# Altium schematic sheet Voltage_Current_Sense.SchDoc
size A4; SheetNumber: 10; SheetTotal: 13
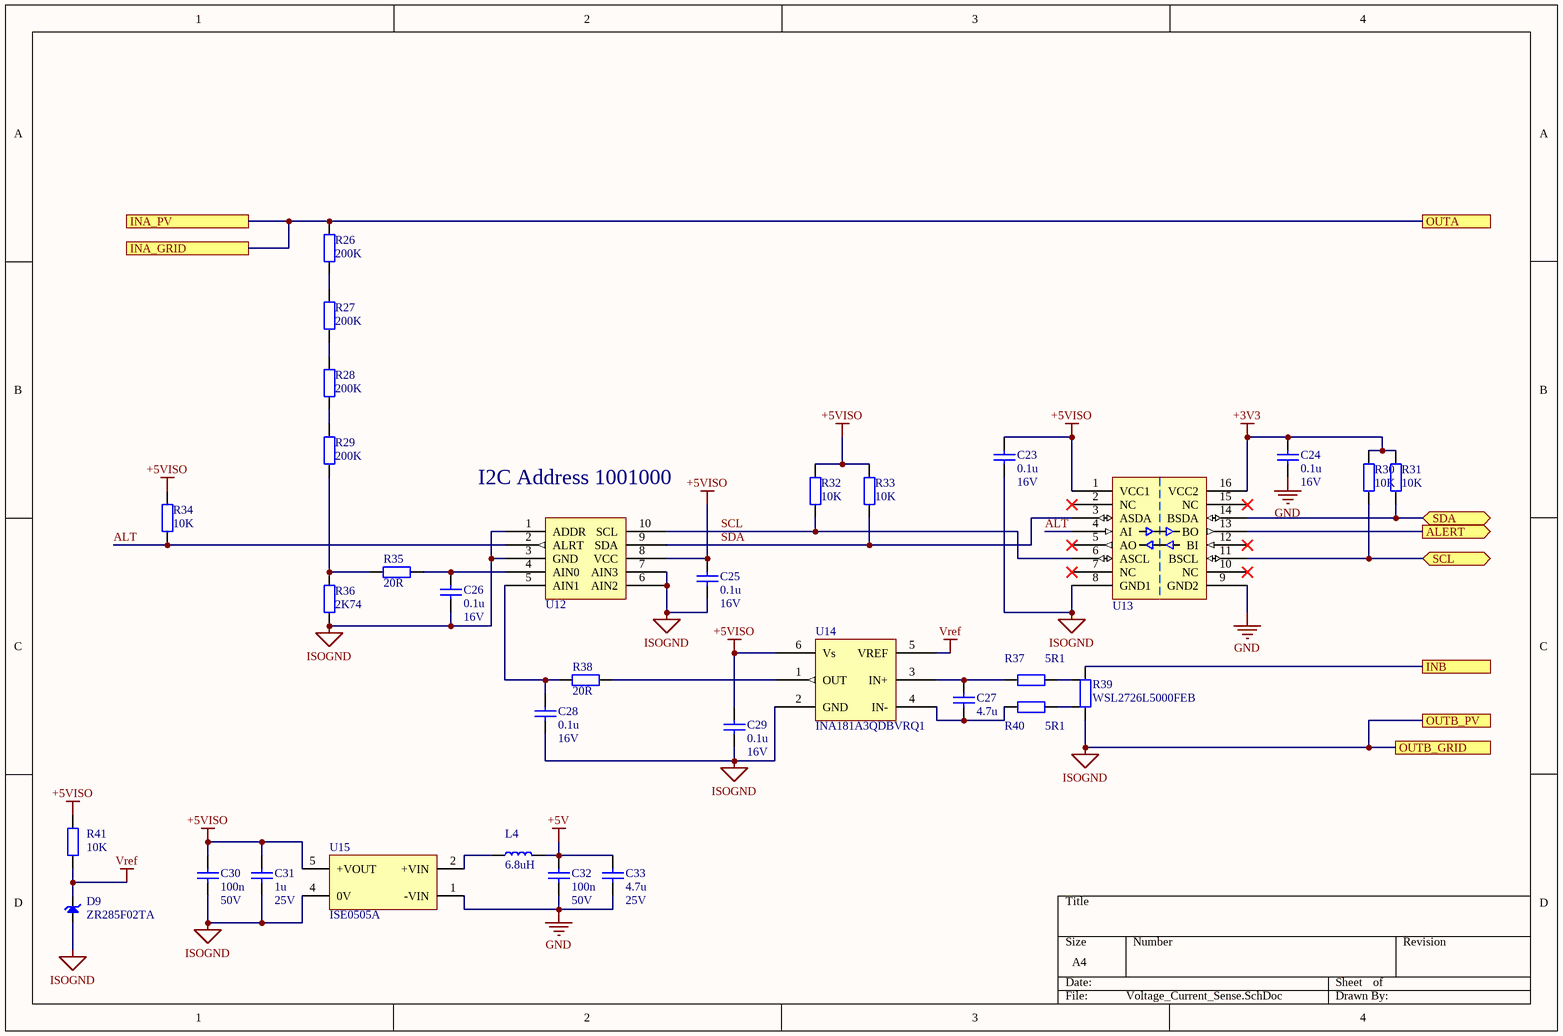
[diagram p0: Voltage_Current_Sense.SchDoc]

## Parts
C23  0.1u  Voltage - Rated: 16V  [CAP 0603/1608]
C24  0.1u  Voltage - Rated: 16V  [CAP 0603/1608]
C25  0.1u  Voltage - Rated: 16V  [CAP 0603/1608]
C26  0.1u  Voltage - Rated: 16V  [CAP 0603/1608]
C27  4.7u  [CAP 0805/2012 - 1.4MM]
C28  0.1u  Voltage - Rated: 16V  [CAP 0603/1608]
C29  0.1u  Voltage - Rated: 16V  [CAP 0603/1608]
C30  100n  Voltage - Rated: 50V  [CAP 0603/1608]
C31  1u  Voltage - Rated: 25V  [CAP 0603/1608]
C32  100n  Voltage - Rated: 50V  [CAP 0603/1608]
C33  4.7u  Voltage - Rated: 25V  [CAP 0603/1608]
D9  ZR285F02TA  [ZR285F02TA]
L4  6.8uH  [1210L]
R26  200K  [RES 1206/3216]
R27  200K  [RES 1206/3216]
R28  200K  [RES 1206/3216]
R29  200K  [RES 1206/3216]
R30  10K  [RES 0603/1608]
R31  10K  [RES 0603/1608]
R32  10K  [RES 0603/1608]
R33  10K  [RES 0603/1608]
R34  10K  [RES 0603/1608]
R35  20R  [RES 0603/1608]
R36  2K74  [RES 1206/3216]
R37  5R1  [RES 0603/1608]
R38  20R  [RES 0603/1608]
R39  WSL2726L5000FEB  [WSL2726L5000FEB]
R40  5R1  [RES 0603/1608]
R41  10K  [RES 0603/1608]
U12  ADS1015IDGSR  [ADS1015IDGSR]  (value not drawn)
U13  SI8605AC-B-IS1R  [SI8605AC-B-IS1R]  (value not drawn)
U14  INA181A3QDBVRQ1  [INA181A3QDBVRQ1]
U15  ISE0505A  [XP ISE 8-SMD]

## Ports
ALERT (out), INA_GRID, INA_PV, INB, OUTA, OUTB_GRID, OUTB_PV, SCL (bidir), SDA (bidir)

## Nets
+3V3: C24.2 R30.2 R31.2 U13.16(VCC2)
+5V: C32.1 C33.2 L4.1
+5VISO: C23.2 C25.2 C29.2 C30.2 C31.2 R32.2 R33.2 R34.2 R41.2 U12.8(VCC) U13.1(VCC1) U14.6(Vs) U15.5(+VOUT)
GND: C24.1 C32.2 C33.1 U13.9(GND2) U15.1(-VIN)
ISOGND: C23.1 C25.1 C26.1 C28.2 C29.1 C30.1 C31.1 D9.A R36.1 R39.1 U12.1(ADDR) U12.3(GND) U12.6(AIN2) U12.7(AIN3) U13.8(GND1) U14.2(GND) U15.4(0V) ; port OUTB_PV, port OUTB_GRID
Vref: D9.K R41.1 U14.5(VREF)
ALERT: U13.13(BO) ; port ALERT
ALT: R34.1 U12.2(ALRT) U13.4(AI)
INA_GRID: R26.2 ; port INA_PV, port OUTA, port INA_GRID
INB: R39.2 ; port INB
SCL: R32.1 U12.10(SCL) U13.6(ASCL)
SCL: R30.1 U13.11(BSCL) ; port SCL  [a separate net that carries the same name]
SDA: R33.1 U12.9(SDA) U13.3(ASDA)
SDA: R31.1 U13.14(BSDA) ; port SDA  [a separate net that carries the same name]
NetC26_2: C26.2 R35.2 U12.4(AIN0)
NetC27_1: C27.1 R40.1 U14.4(IN-)
NetC27_2: C27.2 R37.1 U14.3(IN+)
NetC28_1: C28.1 R38.2 U12.5(AIN1)
NetL4_2: L4.2 U15.2(+VIN)
NetR26_1: R26.1 R27.2
NetR27_1: R27.1 R28.2
NetR28_1: R28.1 R29.2
NetR29_1: R29.1 R35.1 R36.2
NetR37_2: R37.2 R39.4
NetR38_1: R38.1 U14.1(OUT)
NetR39_3: R39.3 R40.2

Not connected (* = marked no-connect by the designer): U13 2(NC)* 5(AO)* 7(NC)* 10(NC)* 12(BI)* 15(NC)*

## Notes on the sheet
- (near U12) I2C Address 1001000

## Library data of the parts
C23-C26 C28 C29 = GRM188R71C104KA01D: CAP CER 0.1UF 16V X7R 0603; Manufacturer: Murata Electronics North America; Package Imperial: 0603; Package Metric: 1608; Tolerance: 0.1; Value: 0.1u; Part Number: GRM188R71C104KA01D; Dielectric: X7R; Digi-Key Part Number: 490-1532-6-ND
C27 = C0805C475K9RACTU: CAP CER 4.7UF 6.3V X7R 0805; Manufacturer: KEMET; Package Imperial: 0805; Package Metric: 2012; Tolerance: 0.1; Value: 4.7u; Voltage - Rated: 6.3V; Part Number: C0805C475K9RACTU; Dielectric: X7R; Digi-Key Part Number: 399-7417-1-ND
C30 C32 = GCM188R71H104KA57D: CAP CER 0.1UF 50V X7R 0603; Manufacturer: Murata Electronics North America; Package Imperial: 0603; Package Metric: 1608; Value: 100n; Part Number: GCM188R71H104KA57D; Digi-Key Part Number: 490-4779-1-ND
C31 = CL10B105KA8NNNC: CAP CER 1UF 25V X7R 0603; Manufacturer: Samsung Electro-Mechanics; Package Imperial: 0603; Package Metric: 1608; Tolerance: 0.1; Value: 1u; Part Number: CL10B105KA8NNNC; Dielectric: X7R; Digi-Key Part Number: 1276-1184-1-ND
C33 = GRM188C81E475KE11D: CAP CER 4.7UF 25V X6S 0603; Manufacturer: Murata Electronics North America; Package Imperial: 0603; Package Metric: 1608; Tolerance: 0.1; Value: 4.7u; Part Number: GRM188C81E475KE11D; Dielectric: X6S; Digi-Key Part Number: 490-7199-1-ND
D9 = ZR285F02TA: Zener Diode; manufacturer: Diodes Incorporated; inventory_price: 1.51; partnumber: ZR285F02TA; Manufacturer Part Number: ZR285F02TA; URL Datasheet: https://www.diodes.com/assets/Datasheets/ZR285.pdf; Digikey PN: ZR285F02CT-ND; parttype: PMIC - Voltage Reference
L4 = TFM322512ALMA6R8MTAA: Part Number: MLZ2012N6R8LTD25; Manufacturer: TDK Corporation; Maximun Temperature: 150; Minimum Temperature: -55; inventory_price: 1.44; Digi-Key Part Number: 445-16384-1-ND; partnumber: TFM322512ALMA6R8MTAA; Manufacturer Part Number: TDK Corporation; URL Datasheet: https://product.tdk.com/info/en/catalog/datasheets/inductor_automotive_power_tfm322512alma_en.pdf?ref_disty=digikey; Digikey PN: 445-TFM322512ALMA6R8MTAACT-ND; parttype: Fixed Inductor
R26-R29 = RC1206FR-07200KL: RES SMD 200K OHM 1% 1/4W 1206; Manufacturer: Yageo; Package Imperial: 1206; Package Metric: 3216; Temperature Coefficient: ±100ppm/°C; Power (Watts): 0.25W, 1/4W; Part Number: RC1206FR-07200KL; Value: 200K; Tolerance: ±1%; Digi-Key Part Number: 311-200KFRCT-ND
R30-R34 R41 = RC0603FR-0710KL: RES SMD 10K OHM 1% 1/10W 0603; Manufacturer: Yageo; Package Imperial: 0603; Package Metric: 1608; Temperature Coefficient: ±100ppm/°C; Power (Watts): 0.1W, 1/10W; Part Number: RC0603FR-0710KL; Value: 10K; Tolerance: ±1%; Digi-Key Part Number: 311-10.0KHRCT-ND
R35 R38 = RC0603FR-0720RL: RES SMD 20 OHM 1% 1/10W 0603; Manufacturer: Yageo; Package Imperial: 0603; Package Metric: 1608; Temperature Coefficient: ±100ppm/°C; Power (Watts): 0.1W, 1/10W; Part Number: RC0603FR-0720RL; Value: 20R; Tolerance: ±1%; Digi-Key Part Number: 311-20.0HRCT-ND
R36 = RC1206FR-072K74L: RES SMD 2.74K OHM 1% 1/4W 1206; Manufacturer: Yageo; Package Imperial: 1206; Package Metric: 3216; Temperature Coefficient: ±100ppm/°C; Power (Watts): 0.25W, 1/4W; Part Number: RC1206FR-072K74L; Value: 2K74; Tolerance: ±1%; Digi-Key Part Number: 311-2.74KFRCT-ND
R37 R40 = RC0603FR-075R1L: RES SMD 5.1 OHM 1% 1/10W 0603; Manufacturer: Yageo; Package Imperial: 0603; Package Metric: 1608; Temperature Coefficient: ±200ppm/°C; Power (Watts): 0.1W, 1/10W; Part Number: RC0603FR-075R1L; Value: 5R1; Tolerance: ±1%; Digi-Key Part Number: YAG3372CT-ND
R39 = WSL2726L5000FEB: Resistor Symbol; manufacturer: Vishay Dale; inventory_price: 3.82; partnumber: WSL2726L5000FEB; Manufacturer Part Number: WSL2726L5000FEB; URL Datasheet: https://www.vishay.com/docs/30131/wsl2726.pdf; Digikey PN: WSLQ-.0005CT-ND; parttype: Chip Resistor - Surface Mount
U12 = ADS1015IDGSR: IC ADC 12BIT SIGMA-DELTA 10VSSOP; Manufacturer: Texas Instruments; inventory_price: 4.47; ComponentLink1Description: Datasheet; Mount: SMT; Supplier 1: Digi-Key; Manufacturer Part Number: ADS1015IDGSR; Supplier Part Number 1: 296-41185-1-ND; partnumber: ADS1015IDGSR; URL Datasheet: https://www.ti.com/general/docs/suppproductinfo.tsp?distId=10&gotoUrl=https%3A%2F%2Fwww.ti.com%2Flit%2Fgpn%2Fads1013; Digikey PN: 296-41185-1-ND; parttype: Data Acquisition - Analog to Digital Converters (ADC)
U13 = SI8605AC-B-IS1R: DGT ISOL 3750VRMS 4CH I2C 16SOIC; Manufacturer: Skyworks Solutions Inc.; inventory_price: 11.35; Manufacturer Part Number: SI8605AC-B-IS1R; ComponentLink1Description: Datasheet; Mount: SMT; Supplier 1: Digi-Key; Supplier Part Number 1: Silicon Labs; partnumber: SI8605AC-B-IS1R; URL Datasheet: https://www.skyworksinc.com/-/media/Skyworks/SL/documents/public/data-sheets/Si860x.pdf; Digikey PN: 336-4927-1-ND; parttype: Digital Isolators
U14 = INA181A3QDBVRQ1: manufacturer: Texas Instraments; inventory_price: 0.94; partnumber: INA181A3QDBVRQ1; Manufacturer Part Number: INA181A3QDBVRQ1; URL Datasheet: https://www.ti.com/general/docs/suppproductinfo.tsp?distId=10&gotoUrl=https%3A%2F%2Fwww.ti.com%2Flit%2Fgpn%2Fina181-q1; Digikey PN: 296-INA181A3QDBVRQ1CT-ND; parttype: Linear - Amplifiers - Instrumentation, OP Amps, Buffer Amps
U15 = ISE0505A: Isolated Module DC DC Converter 1 Output 5V 200mA 4.5V - 5.5V Input; Manufacturer: XP Power; Part Number: ISE0505A; Digi-Key Part Number: 1470-2945-1-ND